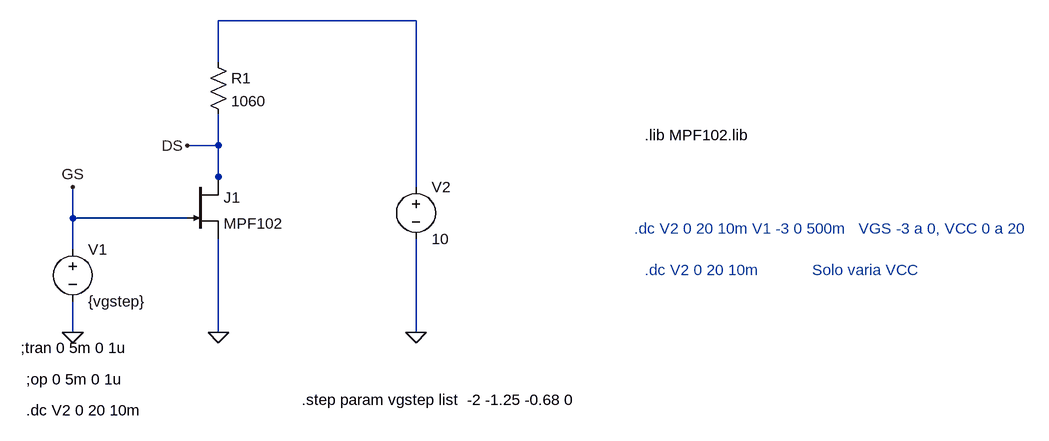
[diagram p0: schematic mpf102-sim.asc]
mpf102-sim.asc, the LTspice schematic file:
Version 4
SHEET 1 1496 680
WIRE 528 -128 224 -128
WIRE 224 -64 224 -128
WIRE 224 64 224 16
WIRE 224 64 176 64
WIRE 224 112 224 64
WIRE 224 128 224 112
WIRE 528 128 528 -128
WIRE 0 176 0 128
WIRE 176 176 0 176
WIRE 0 224 0 176
WIRE 0 352 0 304
WIRE 224 352 224 208
WIRE 528 352 528 208
FLAG 0 352 0
FLAG 224 352 0
FLAG 528 352 0
FLAG 176 64 DS
FLAG 0 128 GS
SYMBOL njf 176 112 R0
SYMATTR InstName J1
SYMATTR Value MPF102
SYMBOL res 208 -80 R0
SYMATTR InstName R1
SYMATTR Value 1060
SYMBOL voltage 528 112 R0
WINDOW 123 0 0 Left 0
WINDOW 39 0 0 Left 0
SYMATTR InstName V2
SYMATTR Value 10
SYMBOL voltage 0 208 R0
WINDOW 123 0 0 Left 0
WINDOW 39 0 0 Left 0
SYMATTR InstName V1
SYMATTR Value {vgstep}
TEXT 880 48 Left 2 !.lib MPF102.lib
TEXT -80 376 Left 2 !;tran 0 5m 0 1u
TEXT -72 424 Left 2 !;op 0 5m 0 1u
TEXT -72 472 Left 2 !.dc V2 0 20 10m
TEXT 864 192 Left 2 ;.dc V2 0 20 10m V1 -3 0 500m   VGS -3 a 0, VCC 0 a 20
TEXT 880 256 Left 2 ;.dc V2 0 20 10m            Solo varia VCC
TEXT 352 456 Left 2 !.step param vgstep list  -2 -1.25 -0.68 0

The netlist it stands for:
* mpf102-sim.asc
J1 DS GS 0 MPF102
R1 N001 DS 1060
V2 N001 0 10
V1 GS 0 {vgstep}
.model NJF NJF
.model PJF PJF
.lib standard.jft
.lib MPF102.lib
;tran 0 5m 0 1u
;op 0 5m 0 1u
.dc V2 0 20 10m
* .dc V2 0 20 10m V1 -3 0 500m   VGS -3 a 0, VCC 0 a 20
* .dc V2 0 20 10m            Solo varia VCC
.step param vgstep list  -2 -1.25 -0.68 0
.backanno
.end